# Altium schematic sheet 9-10-00222-7_Sheet3_REV02_062018.SchDoc: ZPW 204
size A; Revision: 02; SheetNumber: 3; SheetTotal: 3
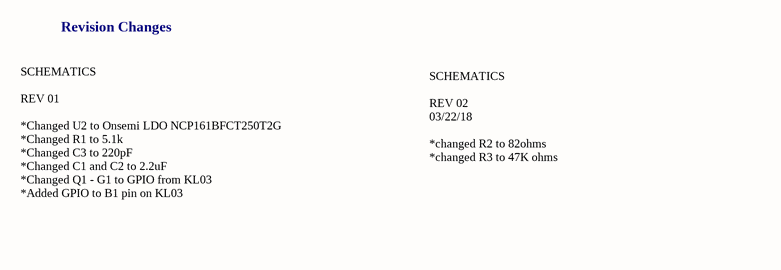
[diagram p0: 9-10-00222-7_Sheet3_REV02_062018.SchDoc]

## Notes on the sheet
- Revision Changes
- SCHEMATICS
  REV 01
  *Changed U2 to Onsemi LDO NCP161BFCT250T2G
  *Changed R1 to 5.1k
  *Changed C3 to 220pF
  *Changed C1 and C2 to 2.2uF
  *Changed Q1 - G1 to GPIO from KL03
  *Added GPIO to B1 pin on KL03
- SCHEMATICS
  REV 02
  03/22/18
  *changed R2 to 82ohms
  *changed R3 to 47K ohms
- Title
- ZPOWER CONFIDENTIAL AND PROPRIETARY
- Size:
- Date:
- A
- Number:
- Time:
- Revision:
- Sheet        of
- File: